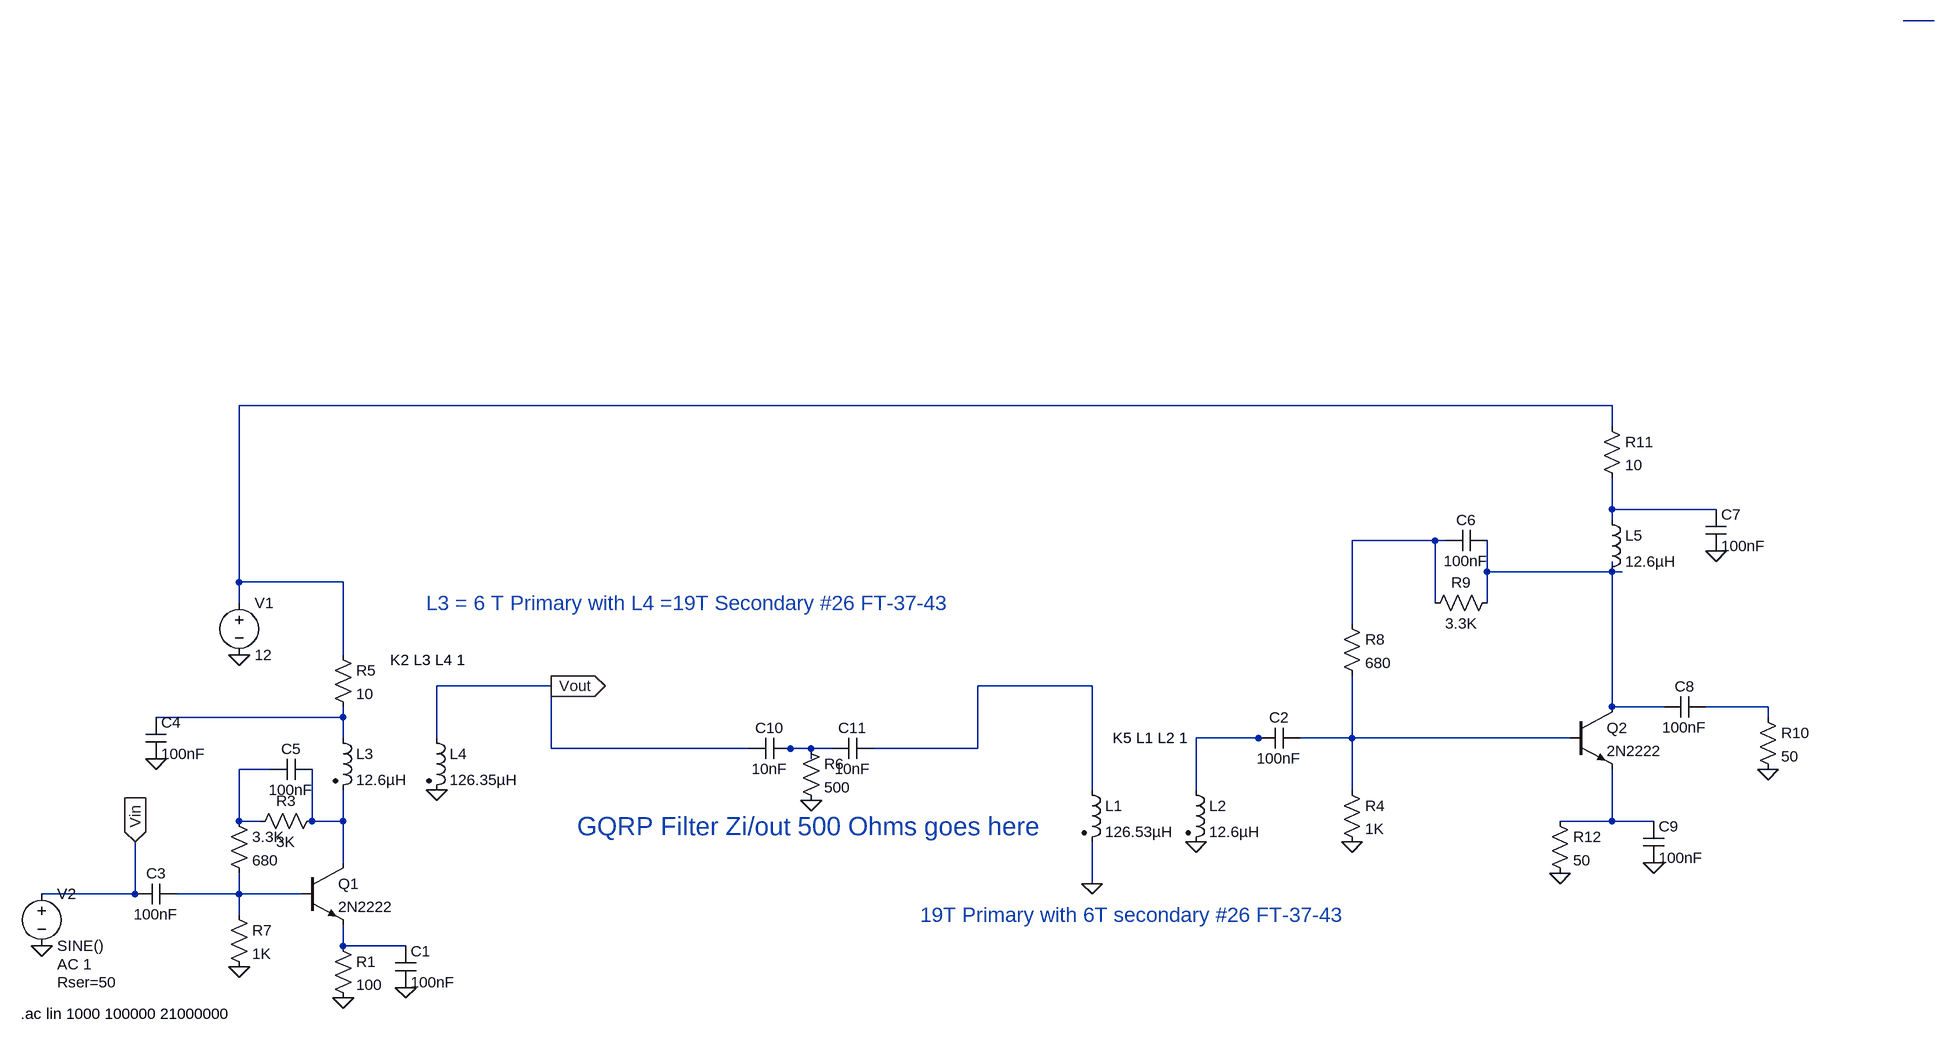
[diagram p0: schematic P3ST_IF_Module.asc]
P3ST_IF_Module.asc, the LTspice schematic file:
Version 4
SHEET 1 2692 680
WIRE 2688 -1184 2640 -1184
WIRE 2192 -592 80 -592
WIRE 2192 -560 2192 -592
WIRE 2192 -432 2192 -480
WIRE 2352 -432 2192 -432
WIRE 2192 -416 2192 -432
WIRE 1920 -384 1792 -384
WIRE 1936 -384 1920 -384
WIRE 2000 -336 2000 -384
WIRE 2192 -336 2192 -352
WIRE 2192 -336 2000 -336
WIRE 2208 -336 2192 -336
WIRE 80 -320 80 -592
WIRE 240 -320 80 -320
WIRE 80 -288 80 -320
WIRE 1920 -288 1920 -384
WIRE 2000 -288 2000 -336
WIRE 1792 -256 1792 -384
WIRE 240 -208 240 -320
WIRE 560 -160 384 -160
WIRE 1392 -160 1216 -160
WIRE 2192 -128 2192 -336
WIRE 2272 -128 2192 -128
WIRE 2432 -128 2336 -128
WIRE 240 -112 240 -128
WIRE 240 -112 -48 -112
WIRE 2432 -112 2432 -128
WIRE 240 -80 240 -112
WIRE 384 -80 384 -160
WIRE 1648 -80 1552 -80
WIRE 1664 -80 1648 -80
WIRE 1792 -80 1792 -176
WIRE 1792 -80 1712 -80
WIRE 2128 -80 1792 -80
WIRE 560 -64 560 -160
WIRE 864 -64 560 -64
WIRE 928 -64 912 -64
WIRE 960 -64 928 -64
WIRE 992 -64 960 -64
WIRE 1216 -64 1216 -160
WIRE 1216 -64 1056 -64
WIRE 960 -48 960 -64
WIRE 128 -32 80 -32
WIRE 1392 0 1392 -160
WIRE 1552 0 1552 -80
WIRE 1792 0 1792 -80
WIRE 80 48 80 -32
WIRE 112 48 80 48
WIRE 192 48 192 -32
WIRE 240 48 240 0
WIRE 240 48 192 48
WIRE 2192 48 2192 -32
WIRE 2192 48 2112 48
WIRE 2256 48 2192 48
WIRE 240 112 240 48
WIRE 1392 144 1392 80
WIRE -80 160 -80 80
WIRE -80 160 -224 160
WIRE -64 160 -80 160
WIRE 80 160 80 128
WIRE 80 160 -16 160
WIRE 176 160 80 160
WIRE 80 192 80 160
WIRE 240 240 240 208
WIRE 336 240 240 240
FLAG 240 320 0
FLAG 336 304 0
FLAG -224 240 0
FLAG 80 272 0
FLAG -48 -48 0
FLAG 80 -208 0
FLAG 560 -160 Vout
IOPIN 560 -160 Out
FLAG -80 80 Vin
IOPIN -80 80 In
FLAG 384 0 0
FLAG 1552 80 0
FLAG 1792 80 0
FLAG 2352 -368 0
FLAG 2432 -32 0
FLAG 2112 128 0
FLAG 2256 112 0
FLAG 1392 144 0
FLAG 960 16 0
SYMBOL npn 176 112 R0
SYMATTR InstName Q1
SYMATTR Value 2N2222
SYMBOL cap 320 240 R0
SYMATTR InstName C1
SYMATTR Value 100nF
SYMBOL res 224 224 R0
SYMATTR InstName R1
SYMATTR Value 100
SYMBOL res 64 32 R0
SYMATTR InstName 3.3K
SYMATTR Value 680
SYMBOL res 208 32 R90
WINDOW 0 0 56 VBottom 2
WINDOW 3 32 56 VTop 2
SYMATTR InstName R3
SYMATTR Value 3K
SYMBOL res 224 -224 R0
SYMATTR InstName R5
SYMATTR Value 10
SYMBOL cap -16 144 R90
WINDOW 0 0 32 VBottom 2
WINDOW 3 32 32 VTop 2
SYMATTR InstName C3
SYMATTR Value 100nF
SYMBOL cap -64 -112 R0
SYMATTR InstName C4
SYMATTR Value 100nF
SYMBOL voltage 80 -304 R0
WINDOW 123 0 0 Left 0
WINDOW 39 0 0 Left 0
SYMATTR InstName V1
SYMATTR Value 12
SYMBOL voltage -224 144 R0
WINDOW 123 24 124 Left 2
WINDOW 39 24 152 Left 2
SYMATTR Value2 AC 1
SYMATTR SpiceLine Rser=50
SYMATTR InstName V2
SYMATTR Value SINE()
SYMBOL cap 192 -48 R90
WINDOW 0 0 32 VBottom 2
WINDOW 3 32 32 VTop 2
SYMATTR InstName C5
SYMATTR Value 100nF
SYMBOL res 64 176 R0
SYMATTR InstName R7
SYMATTR Value 1K
SYMBOL ind2 224 -96 R0
SYMATTR InstName L3
SYMATTR Value 12.6µH
SYMATTR Type ind
SYMBOL ind2 368 -96 R0
SYMATTR InstName L4
SYMATTR Value 126.35µH
SYMATTR Type ind
SYMBOL ind2 1376 -16 R0
SYMATTR InstName L1
SYMATTR Value 126.53µH
SYMATTR Type ind
SYMBOL ind2 1536 -16 R0
SYMATTR InstName L2
SYMATTR Value 12.6µH
SYMATTR Type ind
SYMBOL cap 1712 -96 R90
WINDOW 0 0 32 VBottom 2
WINDOW 3 32 32 VTop 2
SYMATTR InstName C2
SYMATTR Value 100nF
SYMBOL res 1776 -16 R0
SYMATTR InstName R4
SYMATTR Value 1K
SYMBOL res 1776 -272 R0
SYMATTR InstName R8
SYMATTR Value 680
SYMBOL cap 2000 -400 R90
WINDOW 0 0 32 VBottom 2
WINDOW 3 32 32 VTop 2
SYMATTR InstName C6
SYMATTR Value 100nF
SYMBOL res 2016 -304 R90
WINDOW 0 0 56 VBottom 2
WINDOW 3 32 56 VTop 2
SYMATTR InstName R9
SYMATTR Value 3.3K
SYMBOL ind 2176 -432 R0
SYMATTR InstName L5
SYMATTR Value 12.6µH
SYMBOL res 2416 -128 R0
SYMATTR InstName R10
SYMATTR Value 50
SYMBOL npn 2128 -128 R0
SYMATTR InstName Q2
SYMATTR Value 2N2222
SYMBOL res 2176 -576 R0
SYMATTR InstName R11
SYMATTR Value 10
SYMBOL cap 2336 -432 R0
SYMATTR InstName C7
SYMATTR Value 100nF
SYMBOL cap 2336 -144 R90
WINDOW 0 0 32 VBottom 2
WINDOW 3 32 32 VTop 2
SYMATTR InstName C8
SYMATTR Value 100nF
SYMBOL cap 2240 48 R0
SYMATTR InstName C9
SYMATTR Value 100nF
SYMBOL res 2096 32 R0
SYMATTR InstName R12
SYMATTR Value 50
SYMBOL res 944 -80 R0
SYMATTR InstName R6
SYMATTR Value 500
SYMBOL cap 928 -80 R90
WINDOW 0 0 32 VBottom 2
WINDOW 3 32 32 VTop 2
SYMATTR InstName C10
SYMATTR Value 10nF
SYMBOL cap 1056 -80 R90
WINDOW 0 0 32 VBottom 2
WINDOW 3 32 32 VTop 2
SYMATTR InstName C11
SYMATTR Value 10nF
TEXT -256 344 Left 2 !.ac lin 1000 100000 21000000
TEXT 312 -200 Left 2 !K2 L3 L4 1
TEXT 368 -288 Left 3 ;L3 = 6 T Primary with L4 =19T Secondary #26 FT-37-43
TEXT 1424 -80 Left 2 !K5 L1 L2 1
TEXT 600 56 Left 4 ;GQRP Filter Zi/out 500 Ohms goes here
TEXT 1128 192 Left 3 ;19T Primary with 6T secondary #26 FT-37-43

The netlist it stands for:
* P3ST_IF_Module.asc
Q1 N013 N015 N016 0 2N2222
C1 N016 0 100nF
R1 N016 0 100
R§3.3K N012 N015 680
R3 N013 N012 3K
R5 N002 N008 10
C3 N015 Vin 100nF
C4 N008 0 100nF
V1 N002 0 12
V2 Vin 0 SINE() AC 1 Rser=50
C5 N013 N012 100nF
R7 N015 0 1K
L3 N008 N013 12.6µH
L4 Vout 0 126.35µH
L1 N006 0 126.53µH
L2 N009 0 12.6µH
C2 N010 N009 100nF
R4 N010 0 1K
R8 N004 N010 680
C6 N005 N004 100nF
R9 N005 N004 3.3K
L5 N003 N005 12.6µH
R10 N007 0 50
Q2 N005 N010 N014 0 2N2222
R11 N002 N003 10
C7 N003 0 100nF
C8 N007 N005 100nF
C9 N014 0 100nF
R12 N014 0 50
R6 N011 0 500
C10 N011 Vout 10nF
C11 N006 N011 10nF
.model NPN NPN
.model PNP PNP
.lib standard.bjt
.ac lin 1000 100000 21000000
K2 L3 L4 1
* L3 = 6 T Primary with L4 =19T Secondary #26 FT-37-43
K5 L1 L2 1
* GQRP Filter Zi/out 500 Ohms goes here
* 19T Primary with 6T secondary #26 FT-37-43
.backanno
.end